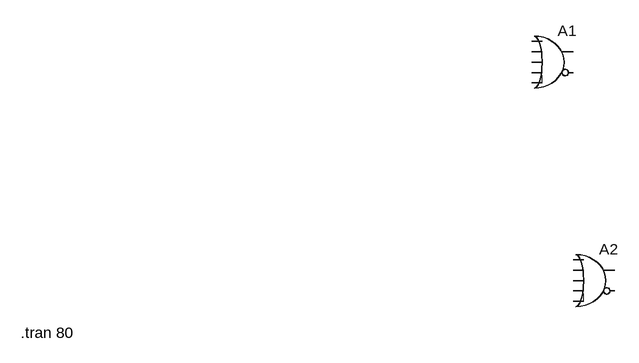
[diagram p0: schematic Draft3.asc]
Draft3.asc, the LTspice schematic file:
Version 4
SHEET 1 920 680
SYMBOL Digital\\or 816 -128 R0
SYMATTR InstName A1
SYMBOL Digital\\or 880 208 R0
SYMATTR InstName A2
TEXT -2 352 Left 2 !.tran 80

The netlist it stands for:
* Draft3.asc
A1 0 0 0 0 0 0 0 0 OR
A2 0 0 0 0 0 0 0 0 OR
.tran 80
.backanno
.end